# EAGLE design console (EAGLE 9.2.1)
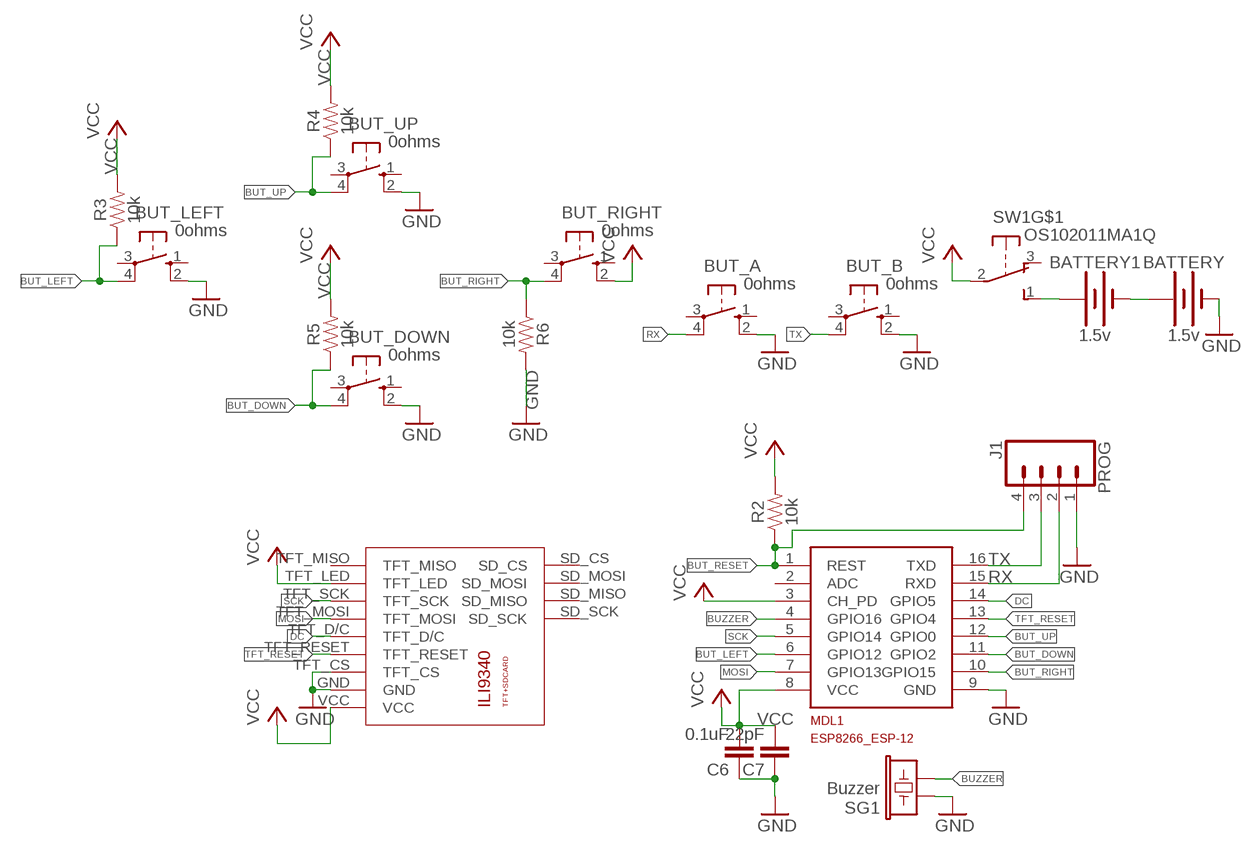
[diagram p0: schematic, sheet 1]

## Parts
BATTERY  1.5v  BATTERY-AA  [BATTERY-AA]
BATTERY1  1.5v  BATTERY-AA  [BATTERY-AA]
BUT_A  0ohms  10-XX  [B3F-10XX]
BUT_B  0ohms  10-XX  [B3F-10XX]
BUT_DOWN  0ohms  10-XX  [B3F-10XX]
BUT_LEFT  0ohms  10-XX  [B3F-10XX]
BUT_RIGHT  0ohms  10-XX  [B3F-10XX]
BUT_UP  0ohms  10-XX  [B3F-10XX]
C6  0.1uF  C-EUC0603  [C0603]
C7  22pF  C-EUC0603  [C0603]
J1  PROG  CONN_041X04_NO_SILK  [1X04_NO_SILK]
MDL1  MCU  ESP8266-12GPIO04/05_CORRECTED  [ESP8266-ESP12]
R2  10k  10KOHM-0603-1/10W-1%  [0603]
R3  10k  10KOHM-0603-1/10W-1%  [0603]
R4  10k  10KOHM-0603-1/10W-1%  [0603]
R5  10k  10KOHM-0603-1/10W-1%  [0603]
R6  10k  10KOHM-0603-1/10W-1%  [0603]
SG1  Buzzer  BUZZERSMD2  [BUZZER-CCV]
SW1  OS102011MA1Q  [OS102011MA1Q]
U$1  ILI9340  [ILI9340]

## Nets
BATT+: BATTERY1.PWR@1(+) SW1.1(S)
BATT_LINK: BATTERY1.GND@1(-) BATTERY.PWR@1(+)
BUT_DOWN: BUT_DOWN.4(P1) MDL1.11(GPIO2) R5.1
BUT_LEFT: BUT_LEFT.4(P1) MDL1.6(GPIO12) R3.1
BUT_RESET: J1.4 MDL1.1(REST) R2.1
BUT_RIGHT: BUT_RIGHT.4(P1) MDL1.10(GPIO15) R6.1
BUT_UP: BUT_UP.4(P1) MDL1.12(GPIO0) R4.1
BUZZER: MDL1.4(GPIO16) SG1.-
DC: MDL1.14(GPIO5) U$1.TFT_D/C
GND: BATTERY.GND@1(-) BUT_A.2(S1) BUT_B.2(S1) BUT_DOWN.2(S1) BUT_LEFT.2(S1) BUT_UP.2(S1) C6.1 C7.1 J1.1 MDL1.9(GND) R6.2 SG1.+ U$1.GND U$1.TFT_CS
MOSI: MDL1.7(GPIO13) U$1.TFT_MOSI
RX: BUT_A.4(P1) J1.2 MDL1.15(RXD)
SCK: MDL1.5(GPIO14) U$1.TFT_SCK
TFT_RESET: MDL1.13(GPIO4) U$1.TFT_RESET
TX: BUT_B.4(P1) J1.3 MDL1.16(TXD)
VCC: BUT_RIGHT.2(S1) C6.2 C7.2 MDL1.3(CH_PD) MDL1.8(VCC) R2.2 R3.2 R4.2 R5.2 SW1.2(P) U$1.TFT_LED U$1.VCC
Unconnected: BUT_A.1(S) BUT_A.3(P) BUT_B.1(S) BUT_B.3(P) BUT_DOWN.1(S) BUT_DOWN.3(P) BUT_LEFT.1(S) BUT_LEFT.3(P) BUT_RIGHT.1(S) BUT_RIGHT.3(P) BUT_UP.1(S) BUT_UP.3(P) MDL1.2(ADC) SW1.3(O) SW1.MT1(MT) SW1.MT2(MT) U$1.SD_CS U$1.SD_MISO U$1.SD_MOSI U$1.SD_SCK U$1.TFT_MISO

## Library data of the parts
BATTERY BATTERY1 = SparkFun-Batteries:BATTERY: Battery - Single Cell A variety of battery chemistries, sizes, and footprints. Device List: 20MM_PTH - Coin Cell Battery Holder - 20mm (PTH) <https://www.sparkfun.com/products/783> 6.8MM_PTH - Coin Cell Battery Holder - 6.8MM(SMD) <https://www.digikey.com/product-detail/en/seiko-instruments/MS621FE-FL11E/728-1057-ND/1889208?WT.srch=1&gclid=CNOQ5a6LzdQCFZS2wAodXCkE0g> 12MM_SMD - Coin Cell Battery Holder - 12mm (SMD) <https://www.sparkfun.com/products/10592> 12MM_PTH - Coin Cell Battery Holder - 12mm (PTH) <https://www.sparkfun.com/products/7948> 20MM_SMD - 20mm Coin Cell Battery Holder (SMD) (2 legs) Used on the Big Time Watch Kit <https://www.sparkfun.com/products/11734> 20MM_SMD_4LEGS - Coin Cell Battery Holder - 20mm (SMD) <https://www.sparkfun.com/products/11892> 20MM_SMD_4LEGS_OVERPASTE - Coin Cell Battery Holder - 20mm (SMD) <https://www.sparkfun.com/products/11892> (Over-paste on the legs) 24.5MM_PTH - Coin Cell Battery Holder - 24.5mm (PTH) <https://www.sparkfun.com/products/8863> 9V - 9V Battery Holder - PC Mount Used on the SparkFun SparkPunk Sound Kit <https://www.sparkfun.com/products/11177> and SparkFun SparkPunk Sequencer Kit <https://www.sparkfun.com/products/12707> 18650 - Battery Holder - 18650 (PTH) <https://www.sparkfun.com/products/13113> AA - Battery Holder - 1xAA (PTH) <https://www.sparkfun.com/products/7949> AAA - Battery Holder - 1xAAA (PTH) <https://www.sparkfun.com/products/12718> AA_KIT - Battery Holder - 1xAA (PTH) <https://www.sparkfun.com/products/7949> Special kit package - pads only have exposed copper on one side of the board. AAA_KIT - Battery Holder - 1xAAA (PTH) <https://www.sparkfun.com/products/12718> Special kit package - pads only have exposed copper on one side of the board.; PROD_ID: BATT-08316; SF_SKU: PRT-07949
BUT_A BUT_B BUT_DOWN BUT_LEFT BUT_RIGHT BUT_UP = switch-omron:10-XX: OMRON SWITCH; MPN: B3F-1000; OC_FARNELL: 176432; OC_NEWARK: 36M3542
C6 C7 = rcl:C-EU: CAPACITOR, European symbol; SPICEPREFIX: C
J1 = SparkFun-Connectors:CONN_04: Multi connection point. Often used as Generic Header-pin footprint for 0.1 inch spaced/style header connections On any of the 0.1 inch spaced packages, you can populate with these: Break Away Headers - Straight <https://www.sparkfun.com/products/116> (PRT-00116) Break Away Male Headers - Right Angle <https://www.sparkfun.com/products/553> (PRT-00553) Female Headers <https://www.sparkfun.com/products/115> (PRT-00115) Break Away Headers - Machine Pin <https://www.sparkfun.com/products/117> (PRT-00117) Break Away Female Headers - Swiss Machine Pin <https://www.sparkfun.com/products/743> (PRT-00743) For SCREWTERMINALS and SPRING TERMINALS visit here: Screw Terimnals on SparkFun.com <https://www.sparkfun.com/search/results?term=Screw+Terminals> (5mm/3.5mm/2.54mm spacing) This device is also useful as a general connection point to wire up your design to another part of your project. Our various solder wires solder well into these plated through hole pads. Hook-Up Wire - Assortment (Stranded, 22 AWG) <https://www.sparkfun.com/products/11375> (PRT-11375) Hook-Up Wire - Assortment (Solid Core, 22 AWG) <https://www.sparkfun.com/products/11367> (PRT-11367) View the entire wire category on our website here <https://www.sparkfun.com/categories/141> Special notes: Molex polarized connector foot print use with SKU : PRT-08231 with associated crimp pins and housings. 1MM SMD Version SKU: PRT-10208; PROD_ID: CONN-09696
MDL1 = ESP8266-ESP12:ESP8266-12: Espressif ESP8266 ESP-12 Module with GPIO04 and GPIO05 corrected.
R2-R6 = SparkFun-Resistors:10KOHM: 10kΩ resistor A resistor is a passive two-terminal electrical component that implements electrical resistance as a circuit element. Resistors act to reduce current flow, and, at the same time, act to lower voltage levels within circuits. - Wikipedia; PROD_ID: RES-00824
SG1 = ThingMagic_Module:BUZZER: Buzzer 12mm Spark Fun Electronics SKU : Comp-Buzzer; PROD_ID: COMP-08568
SW1 = adafruit:OS102011MA1Q: OS10201MA1Q through-hole right angle switch http://www.ladyada.net/library/eagle
U$1 = ili9340:ILI9340

## Board
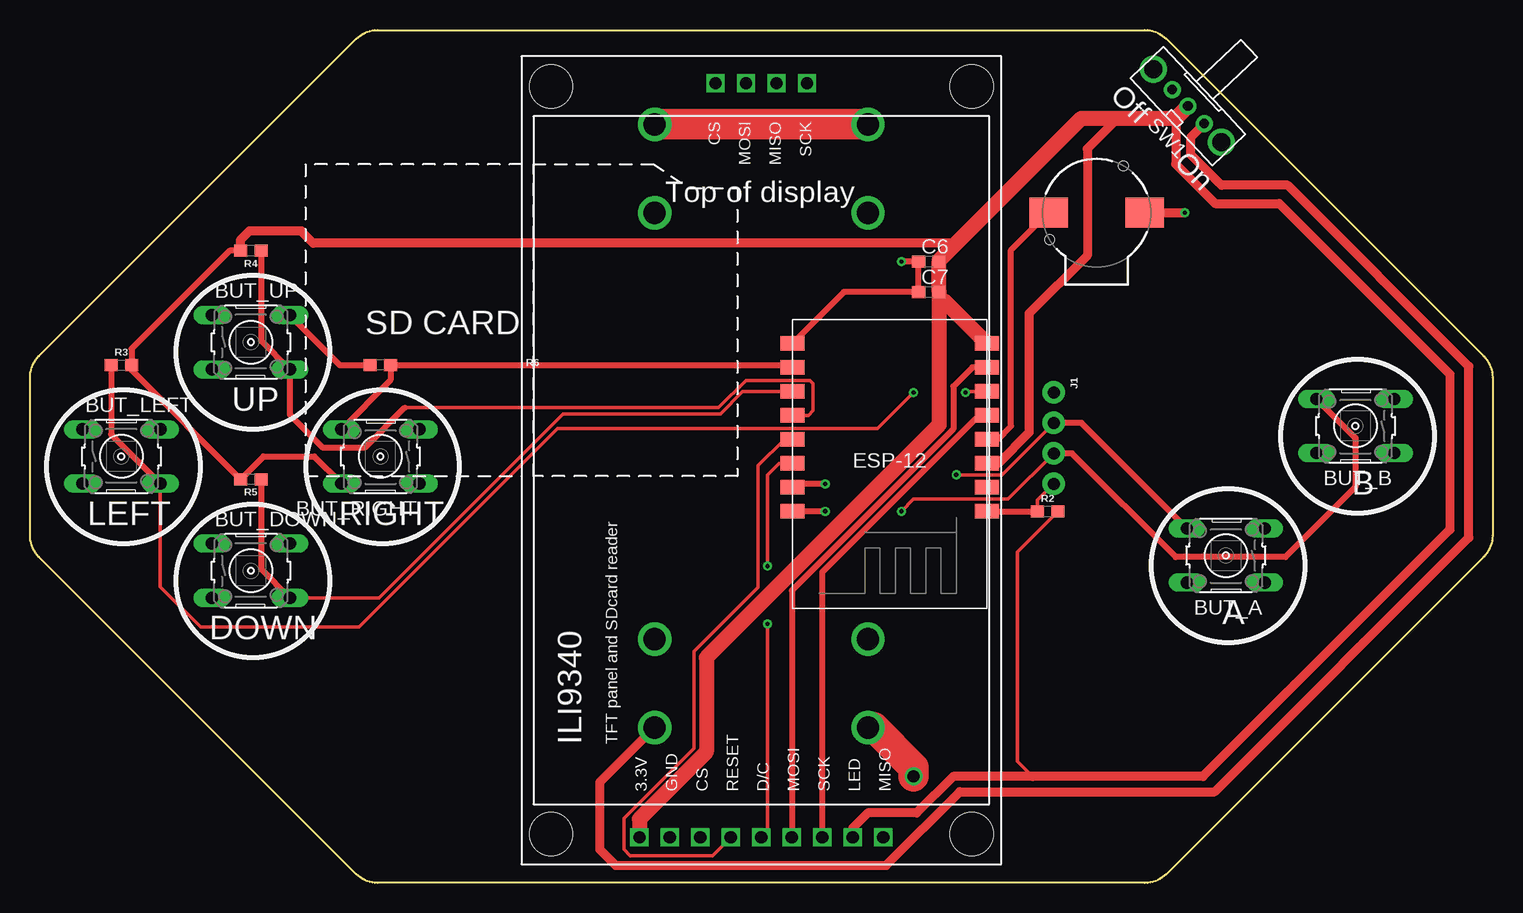
[diagram p1: board, top side]
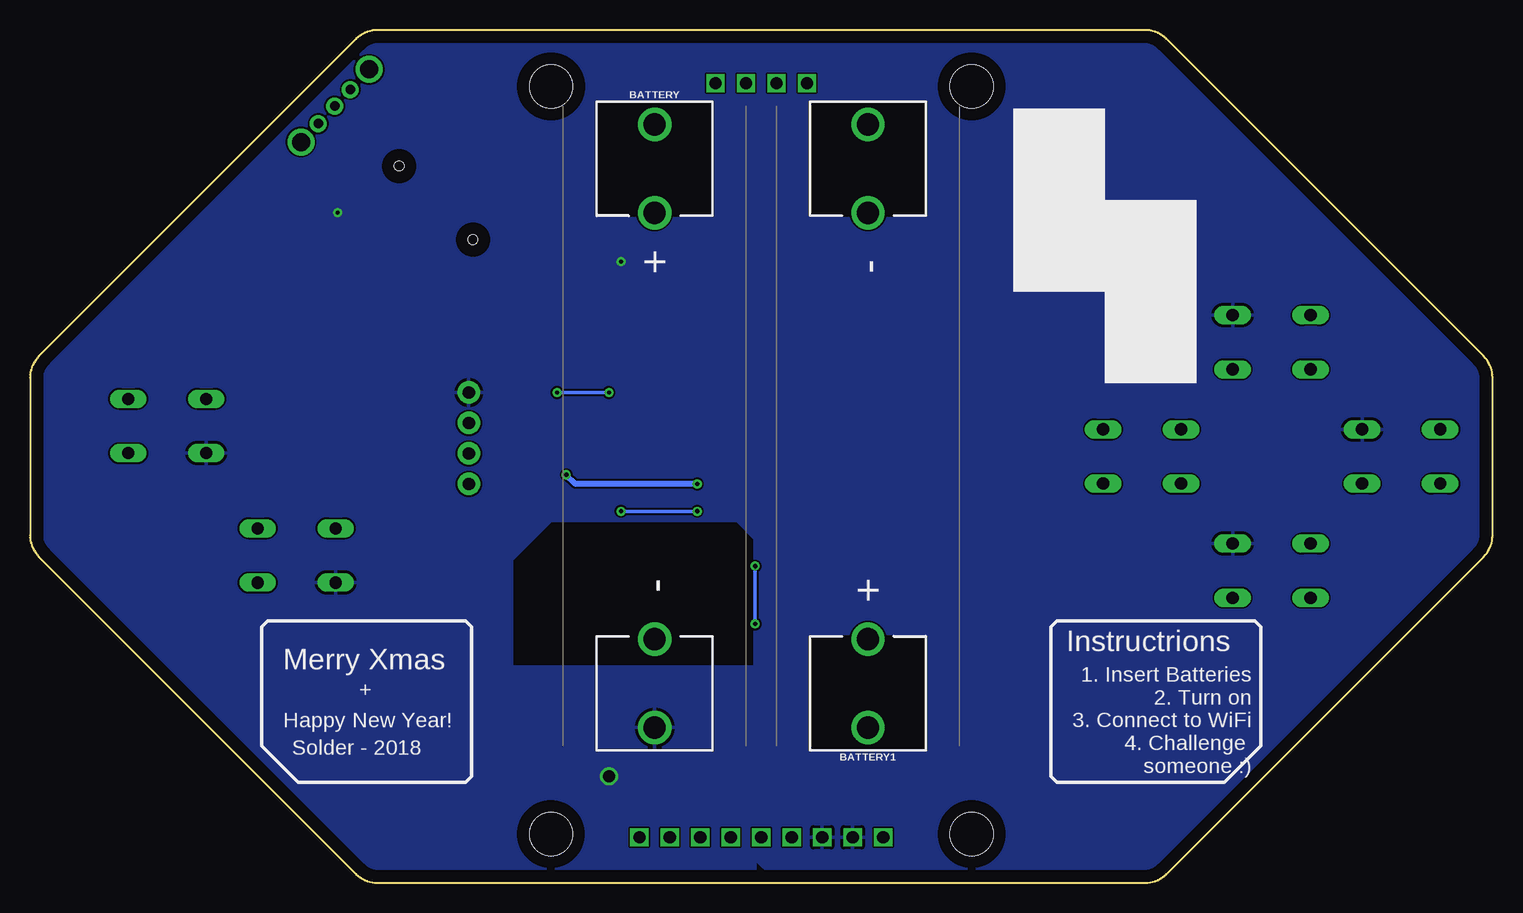
[diagram p2: board, bottom side, seen from below]

Size 121.92 x 71.12 mm. Coordinates in mm from the lower left corner, seen from the top.
Outline: 121.18,27.2 94.72,0.74 arc-45 92.93,0 28.99,0 arc-45 27.2,0.74 0.74,27.2 arc-45 0,28.99 0,42.13 arc-45 0.74,43.92 27.2,70.38 arc-45 28.99,71.12 92.93,71.12 arc-45 94.72,70.38 121.18,43.92 arc-45 121.92,42.13 121.92,28.99 arc-45 121.18,27.2
Copper layers (1*16): Top 0.035mm / dielectric 1.5mm / Bottom 0.035mm
Design rules "default": minimum track width 6mil, minimum drill 0.35mm, track to track 6mil, track to pad 6mil, pad to pad 6mil, via to via 6mil, smd to smd 6mil, copper to edge 40mil, drill to drill 6mil, minimum pad ring 10mil, minimum via ring 8mil, stop-mask expansion 4mil, vias tented up to drill 0mil, thermal gap 10mil

### Footprints (pad centres in the part's own frame; a part is rotated, then mirrored left to right if it is on the bottom)
BATTERY-AA = drill 1.854: GND@1 25.146,0; GND@2 17.78,0; PWR@1 -25.146,0; PWR@2 -17.78,0
B3F-10XX = drill 1.016 long: 1 -3.251,2.261; 2 3.251,2.261; 3 -3.251,-2.261; 4 3.251,-2.261
C0603 = smd 1.1 x 1: 1 -0.85,0; 2 0.85,0
1X04_NO_SILK = drill 1.016 pad 1.88: 1 0,0; 2 2.54,0; 3 5.08,0; 4 7.62,0
ESP8266-ESP12 = smd 2 x 1.2: 1 0,16; 2 0,14; 3 0,12; 4 0,10; 5 0,8; 6 0,6; 7 0,4; 8 0,2; 9 16.2,2; 10 16.2,4; 11 16.2,6; 12 16.2,8; 13 16.2,10; 14 16.2,12; 15 16.2,14; 16 16.2,16
0603 = smd 1.1 x 1: 1 -0.85,0; 2 0.85,0
BUZZER-CCV = smd 3.2 x 2.5: + 4,0; - -4,0 | hole 0.8: -3.9,-2.25; 2.25,3.9
OS102011MA1Q = drill 0.8 pad 1.422: 1 -2,0; 2 0,0; 3 1.9,0 | drill 1.5 pad 2.184: MT1 -4.1,0; MT2 4.2,0
ILI9340 = drill 1.016 square: GND -7.62,-31.75; SD_CS -3.81,31.115; SD_MISO 1.27,31.115; SD_MOSI -1.27,31.115; SD_SCK 3.81,31.115; TFT_CS -5.08,-31.75; TFT_D/C 0,-31.75; TFT_LED 7.62,-31.75; TFT_MISO 10.16,-31.75; TFT_MOSI 2.54,-31.75; TFT_RESET -2.54,-31.75; TFT_SCK 5.08,-31.75; VCC -10.16,-31.75 | hole 3.6: -17.526,30.861; 17.526,30.861; -17.526,-31.496; 17.526,-31.496

### Placement (x,y rotation side)
BATTERY  69.85,38.1 270 bottom
BATTERY1  52.07,38.1 90 bottom
BUT_A  99.69,27.3 180 top
BUT_B  110.49,38.1 180 top
BUT_DOWN  18.41,26.04 0 top
BUT_LEFT  7.62,35.56 0 top
BUT_RIGHT  29.21,35.56 180 top
BUT_UP  18.41,45.09 0 top
C6  74.93,51.82 0 top
C7  74.93,49.28 0 top
J1  85.34,40.89 270 top
MDL1  79.76,46.99 180 top
R2  84.84,30.99 0 top
R3  7.62,43.18 0 top
R4  18.41,52.71 180 top
R5  18.41,33.66 180 top
R6  29.21,43.18 180 top
SG1  88.9,55.88 0 top
SW1  96.52,64.77 133.2 top
U$1  60.96,35.56 0 top

### Tracks (layer width: path | path; a pad name or v marks a point on that pad's centre or on a via)
BATT+
  Top 0.762: BATTERY1.PWR@1 47.5,8.38 47.5,2.79 48.82,1.47 71.37,1.47 77.52,7.62 98.75,7.62 119.94,28.8 119.94,43.08 104.85,58.17 99.31,58.17 96.77,60.71 96.77,62.2 SW1.1
BATT_LINK
  Top 2.54: BATTERY1.GND@1 BATTERY.PWR@1
BUT_DOWN
  Top 0.305: BUT_DOWN.4 29.11,23.77 44.45,39.12 57.54,39.12 59.42,40.99 MDL1.11
  Top 0.508: R5.1 19.27,26.18 BUT_DOWN.4
BUT_LEFT  (via drill 0.35)
  Top 0.305: BUT_LEFT.4 10.87,24.69 14.22,21.34 27.43,21.34 43.99,37.9 70.66,37.9 v73.66,40.89 | v77.98,40.89 78.07,40.99 MDL1.6
  Top 0.508: R3.1 6.77,37.4 BUT_LEFT.4
  Bottom 0.305: v73.66,40.89 v77.98,40.89
BUT_RESET
  Top 0.305: R2.1 83.98,31.91 J1.4
  Top 0.508: MDL1.1 R2.1
BUT_RIGHT
  Top 0.508: BUT_RIGHT.4 30.06,41.92 R6.1 63.37,43.18 MDL1.10
BUT_UP
  Top 0.305: 31.24,39.62 57.4,39.62 59.69,41.91 65.02,41.91 65.28,41.66 65.28,39.37 64.9,38.99 MDL1.12
  Top 0.508: R4.1 19.27,45.23 BUT_UP.4 21.67,39.04 24.38,36.32 27.94,36.32 31.24,39.62
BUZZER
  Top 0.508: MDL1.4 80.68,36.99 81.79,38.1 81.79,52.78 84.31,55.3 84.32,55.3 SG1.-
DC  (via drill 0.35)
  Top 0.305: MDL1.14 62.42,34.99 61.47,34.04 v61.47,26.42 | v61.47,21.59 61.47,4.32 U$1.TFT_D/C
  Bottom 0.305: v61.47,26.42 v61.47,21.59
GND  (via drill 0.35, 0.99)
  Top 0.508: BUT_UP.2 25.83,43.18 R6.2 | MDL1.9 67.84,49.28 C7.1 C6.1 v72.64,51.82
  Top 0.762: SG1.+ v96.27,55.88
  Top 2.54: BATTERY.GND@1 70.36,12.95 73.66,9.65 v73.66,8.89
  pour Bottom: 27.94,70.61 93.73,70.61 121.41,42.93 121.41,28.19 93.73,0.51 81.79,0.51 81.79,26.92 78.49,30.23 62.99,30.23 61.47,28.7 61.47,2.03 59.94,0.51 28.19,0.51 0.25,28.45 0.25,42.93
  pour Bottom: 61.47,18.03 81.79,18.03 81.79,0.51 61.47,0.51
MOSI
  Top 0.508: MDL1.7 78.55,42.99 76.96,41.4 76.96,37.85 63.5,24.38 U$1.TFT_MOSI
RX  (via drill 0.35)
  Top 0.305: J1.2 81.03,34.04 v77.22,34.04
  Top 0.508: v66.29,33.27 63.84,33.27 MDL1.15 | BUT_A.4 87.66,38.35 J1.2
  Bottom 0.508: v66.29,33.27 76.45,33.27 v77.22,34.04
SCK
  Top 0.508: MDL1.5 79.12,38.99 66.04,25.91 U$1.TFT_SCK
TFT_RESET
  Top 0.305: MDL1.13 62.9,36.99 60.71,34.8 60.71,24.64 55.37,19.3 55.37,11.24 49.53,5.39 49.53,2.79 50.04,2.29 56.9,2.29 U$1.TFT_RESET
TX  (via drill 0.35)
  Top 0.305: J1.3 81.53,32 73.66,32 v72.64,30.99
  Top 0.508: v66.29,30.99 MDL1.16 | BUT_B.4 110.49,37.11 110.49,33.02 104.65,27.18 95.5,27.18 86.87,35.81 J1.3
  Bottom 0.305: v72.64,30.99 v66.29,30.99
VCC
  Top 0.305: R2.2 82.3,27.6 82.3,10.16 83.57,8.89
  Top 0.508: R4.2 16.64,52.71 8.47,44.54 R3.2 8.47,42.75 R5.2 19.47,35.56 23.7,35.56 BUT_RIGHT.2
  Top 0.762: 90.68,63.75 88.14,61.21 88.14,52.32 83.31,47.5 83.31,37.59 80.71,34.99 MDL1.3 | C7.2 75.78,48.97 76.2,48.55 | C6.2 75.78,51.9 | 95.5,63.75 95.5,59.94 98.81,56.64 104.14,56.64 118.36,42.42 118.36,29.46 97.79,8.89 83.57,8.89 76.96,8.89 73.91,5.84 69.85,5.84 68.58,4.57 U$1.TFT_LED | 77.22,53.34 23.62,53.34 22.61,54.36 18.29,54.36 17.53,53.59 17.53,52.74 R4.2
  Top 1.27: C6.2 C7.2 75.78,38.19 56.39,18.8 56.39,10.92 50.8,5.33 U$1.VCC | SW1.2 95.5,63.75 90.68,63.75 87.63,63.75 77.22,53.34 75.78,51.9 | MDL1.8 76.2,48.55

### Text on the board
tPlace: Off | On | UP | B | LEFT | RIGHT | A | DOWN
bPlace: Instructrions | 1. Insert Batteries / 2. Turn on / 3. Connect to WiFi / 4. Challenge / someone :) | Merry Xmas | + | Happy New Year! | Solder - 2018